# Altium schematic sheet GSM SIM Socket.SchDoc: GSM SIM Socket
size 292 x 193 mm; DocumentNumber: 15; SheetNumber: 30; SheetTotal: 40
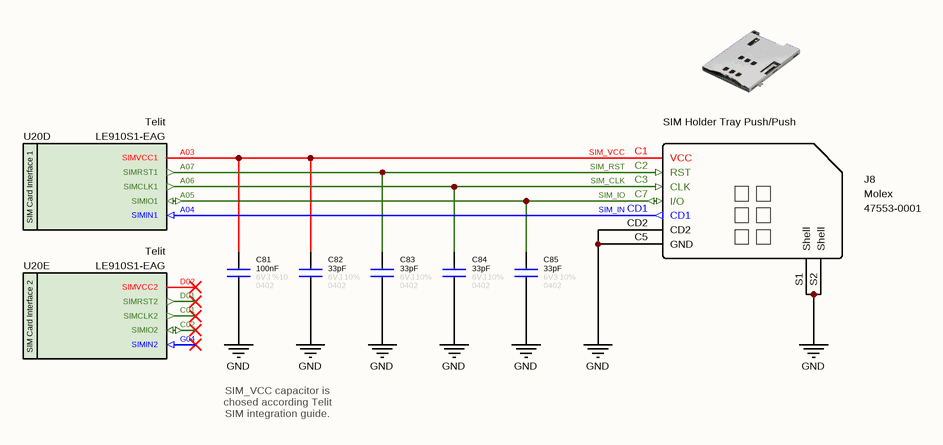
[diagram p0: GSM SIM Socket.SchDoc]

## Parts
C81  value 100nF  Tolerance: %10  Voltage: 6V3  Case: 0402  [CAPACITOR_0402]  (hidden comment: Capacitor - 100nF [0402] (Ceramic))
C82  value 33pF  Tolerance: 10%  Case: 0402  Voltage: 6V3  [CAPACITOR_0402]  (hidden comment: Capacitor - 33pF [0402] (Ceramic))
C83  value 33pF  Tolerance: 10%  Case: 0402  Voltage: 6V3  [CAPACITOR_0402]  (hidden comment: Capacitor - 33pF [0402] (Ceramic))
C84  value 33pF  Tolerance: 10%  Case: 0402  Voltage: 6V3  [CAPACITOR_0402]  (hidden comment: Capacitor - 33pF [0402] (Ceramic))
C85  value 33pF  Tolerance: 10%  Case: 0402  Voltage: 6V3  [CAPACITOR_0402]  (hidden comment: Capacitor - 33pF [0402] (Ceramic))
J8  Card Type: SIM Holder Tray Push/Push  Manufacturer Name: Molex  Manufacturer Part Number: 47553-0001  [CONNECTOR - SIM Card]  (hidden comment: SIM Holder Tray)
U20  Manufacturer Part Number: LE910S1-EAG  Manufacturer Name: Telit  [LE910 GSM Modem]  (hidden comment: LE910S1-EAG LTE GSM Module)  (parts D,E of 19)

## Nets
GND: C81.1 C82.1 C83.1 C84.1 C85.1 J8.C5(GND) J8.CD2 J8.S1(Shell) J8.S2(Shell)
SIM_CLK: C84.2 J8.C3(CLK) U20.A06(SIMCLK1)
SIM_IN: J8.CD1 U20.A04(SIMIN1)
SIM_IO: C85.2 J8.C7(I/O) U20.A05(SIMIO1)
SIM_RST: C83.2 J8.C2(RST) U20.A07(SIMRST1)
SIM_VCC: C81.2 C82.2 J8.C1(VCC) U20.A03(SIMVCC1)

Not connected (* = marked no-connect by the designer): U20 C01(SIMCLK2)* C02(SIMIO2)* D01(SIMRST2)* D02(SIMVCC2)* G04(SIMIN2)*

## Notes on the sheet
- SIM_VCC capacitor is chosed according Telit SIM integration guide.
- © 2021 All rights reserved.
  This document may not, in whole or in part, be copied, photocopied, reproduced, translated or converted to any electronic or machine readable from without prior written permission of Mehmet Günce Akkoyun.
  Engineer contact : akkoyun@me.com
- Property of
- Engineer :
- Date :
- Size :
- A4
- Time :
- Project :
- Page :
- /
- Customer :
- Product ID :
- Module ID :
- Version :
- File :
- Revision :
- (in symbol IC - LE910S1-EAG, part D) SIM Card Interface 1
- (in symbol IC - LE910S1-EAG, part E) SIM Card Interface 2

## Library data of the parts
C81 = Capacitor - 100nF [0402-6V3]: Capacitor - 100nF [0402-6V3] (Ceramic); Manufacturer Name: AVX; Manufacturer Part Number: 04026D104KAT4A; ComponentLink1Description: Mouser; ComponentLink1URL: https://www.mouser.com.tr/ProductDetail/AVX/04026D104KAT4A?qs=sGAEpiMZZMs0AnBnWHyRQPg4iYkCw7IMED%2F4kpqgf7w%3D; ComponentLink2Description: DataSheet; ComponentLink2URL: https://www.mouser.com.tr/datasheet/2/40/cx5r-776519.pdf
C82-C85 = Capacitor - 33pF [0402-6V3]: Manufacturer Name: Kemet; Manufacturer Part Number: C0402C330J9RACAUTO; ComponentLink1Description: DataSheet; ComponentLink1URL: https://api.kemet.com/component-edge/download/datasheet/C0402C330J9RACAUTO.pdf; ComponentLink2Description: Mouser; ComponentLink2URL: https://www.mouser.com/Search/Refine.aspx?Keyword=80-C0402C330J9RAUTO
J8 = Connector - Sim Holder: Memory Card Connectors ASSY 1.90 SIM CARD R IM CARD READER CONN.
U20 = IC - LE910S1-EAG: Telit LE910S1-EAG GPRS/GNSS Module; Case: BGA